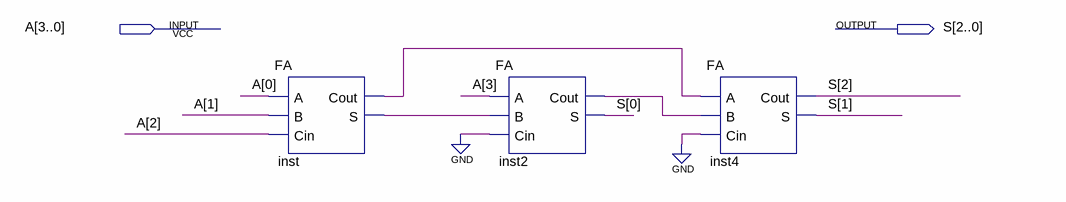
[diagram p0: schematic sheet]
// Quartus schematic BitsAdder.bdf as structural Verilog: 3 symbols, 2 pins
module BitsAdder (
  input  [3:0] A,
  output [2:0] S
);

  wire inst2_cout, inst_cout, inst_s;

  FA inst (.A(A[0]), .B(A[1]), .Cin(A[2]), .Cout(inst_cout), .S(inst_s));
  FA inst2 (.A(A[3]), .B(inst_s), .Cin(1'b0), .Cout(inst2_cout), .S(S[0]));
  FA inst4 (.A(inst_cout), .B(inst2_cout), .Cin(1'b0), .Cout(S[2]), .S(S[1]));
endmodule
